# EAGLE design GSM_Relay (EAGLE 7.2.0)
COMPANY: ADAFRUIT INDUSTRIES; DRAWN: KTOWN; REV: C
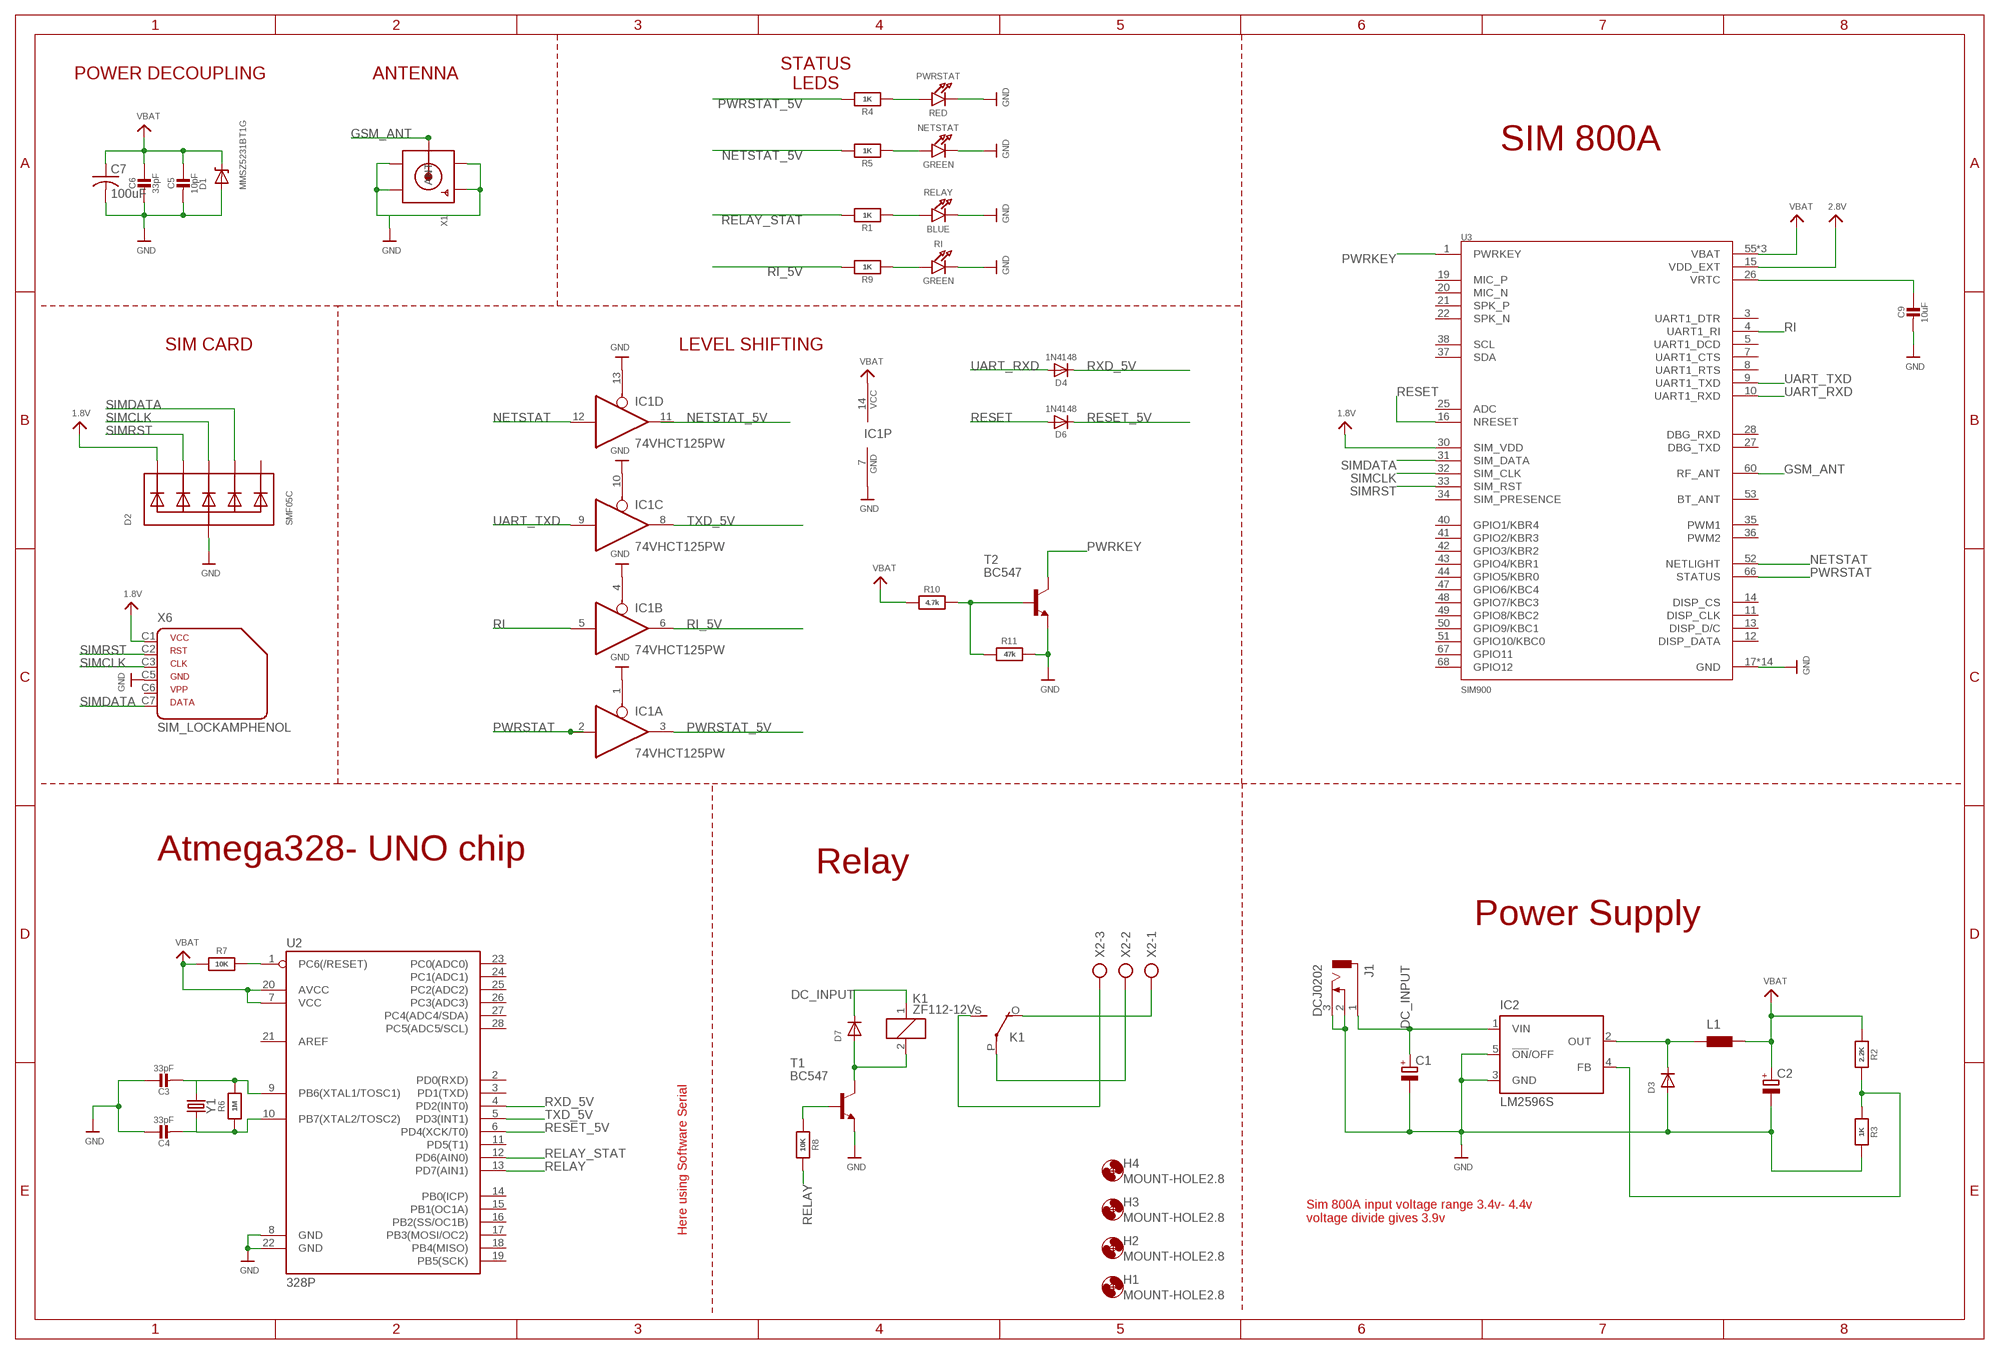
[diagram p0: schematic, sheet 1]

## Parts
C1  CPOL-EUE  [PANASONIC_E]
C2  CPOL-EUE  [PANASONIC_E]
C3  33pF  CAP_CERAMIC0805-NOOUTLINE  [0805-NO]
C4  33pF  CAP_CERAMIC0805-NOOUTLINE  [0805-NO]
C5  10pF  CAP_CERAMIC0805-NOOUTLINE  [0805-NO]
C6  33pF  CAP_CERAMIC0805-NOOUTLINE  [0805-NO]
C7  100uF  C-USC1210  [C1210]
C9  10uF  CAP_CERAMIC0805-NOOUTLINE  [0805-NO]
D1  MMSZ5231BT1G  DIODE-ZENERSOD123  [SOD-123]
D2  SMF05C  TVSARRAY_5LANE  [SOT363]
D3  DIODESMA  [SMADIODE]
D4  1N4148  DIODESOD-323  [SOD-323]
D6  1N4148  DIODESOD-323  [SOD-323]
D7  DIODESMA  [SMADIODE]
H1  MOUNT-HOLE2.8  [2,8]
H2  MOUNT-HOLE2.8  [2,8]
H3  MOUNT-HOLE2.8  [2,8]
H4  MOUNT-HOLE2.8  [2,8]
IC1  74VHCT125PW  74ABT125PW  [TSSOP14]
IC2  LM2596S  [TO263-5]
J1  DCJ0202  [DCJ0202]
K1  ZF112-12V  ZF112  [ZF112]
L1  PIS4720  [PIS4720]
NETSTAT  GREEN  LED0805_NOOUTLINE  [CHIPLED_0805_NOOUTLINE]
PWRSTAT  RED  LED0805_NOOUTLINE  [CHIPLED_0805_NOOUTLINE]
R1  1K  RESISTOR0805_NOOUTLINE  [0805-NO]
R2  2.2K  RESISTOR0805_NOOUTLINE  [0805-NO]
R3  1K  RESISTOR0805_NOOUTLINE  [0805-NO]
R4  1K  RESISTOR0805_NOOUTLINE  [0805-NO]
R5  1K  RESISTOR0805_NOOUTLINE  [0805-NO]
R6  1M  RESISTOR0805_NOOUTLINE  [0805-NO]
R7  10K  RESISTOR0805_NOOUTLINE  [0805-NO]
R8  10K  RESISTOR0805_NOOUTLINE  [0805-NO]
R9  1K  RESISTOR0805_NOOUTLINE  [0805-NO]
R10  4.7k  RESISTOR0805_NOOUTLINE  [0805-NO]
R11  47k  RESISTOR0805_NOOUTLINE  [0805-NO]
RELAY  BLUE  LED0805_NOOUTLINE  [CHIPLED_0805_NOOUTLINE]
RI  GREEN  LED0805_NOOUTLINE  [CHIPLED_0805_NOOUTLINE]
T1  BC547  2N2222  [TO92-EBC-OVAL]
T2  BC547  2N2222  [TO92-EBC-OVAL]
U2  328P  ATMEGA328P_PDIP  [DIP28]
U3  SIM900  [QFN100P2400X2400X300-68N]
X1  SMACONNECTOR  [SMA90_DIP]
X2  AK300/3  [AK300/3]
X6  SIM_LOCKAMPHENOL  [C707_10M006_512_2]
Y1  CRYSTALPTH-HC49UV  [HC49U]

## Nets
1.8V: D2.1(C1) U3.30(SIM_VDD) X6.C1
2.8V: U3.15(VDD_EXT)
DC_INPUT: C1.+ D7.C IC2.1(VIN) J1.1 K1.1
FEEDBACK: IC2.4(FB) R2.2 R3.1
GND: C1.- C2.- C3.1 C4.1 C5.2 C6.2 C7.2 C9.2 D1.A D2.2(A) D3.A IC1.1(A:OE) IC1.4(B:OE) IC1.7(P:GND) IC1.10(C:OE) IC1.13(D:OE) IC2.3(GND) IC2.5(!ON!/OFF) J1.2 J1.3 NETSTAT.C PWRSTAT.C R3.2 R11.2 RELAY.C RI.C T1.E T2.E U2.8(GND) U2.22(GND) U3.17(GND) U3.18(GND) U3.29(GND) U3.39(GND) U3.45(GND) U3.46(GND) U3.54(GND) U3.58(GND) U3.59(GND) U3.61(GND) U3.62(GND) U3.63(GND) U3.64(GND) U3.65(GND) X1.GND1 X1.GND2 X1.GND3 X1.GND4 X6.C5
GSM_ANT: U3.60(RF_ANT) X1.ANTENNA(ANT)
N$1: R1.1 RELAY.A
N$2: D7.A K1.2 T1.C
N$3: R8.1 T1.B
N$4: PWRSTAT.A R4.1
N$5: D3.C IC2.2(OUT) L1.P$1
N$6: C3.2 R6.2 U2.9(PB6(XTAL1/TOSC1)) Y1.1
N$7: C4.2 R6.1 U2.10(PB7(XTAL2/TOSC2)) Y1.2
N$8: R9.1 RI.A
N$9: NETSTAT.A R5.1
N$10: K1.O(2:O) X2.1
N$11: K1.P(2:P) X2.2
N$12: R7.2 U2.1(PC6(/RESET))
N$13: R10.2 R11.1 T2.B
N$14: K1.S(2:S) X2.3
NETSTAT: IC1.12(D:I) U3.52(NETLIGHT)
NETSTAT_5V: IC1.11(D:O) R5.2
PWRKEY: T2.C U3.1(PWRKEY)
PWRSTAT: IC1.2(A:I) U3.66(STATUS)
PWRSTAT_5V: IC1.3(A:O) R4.2
RELAY: R8.2 U2.13(PD7(AIN1))
RELAY_STAT: R1.2 U2.12(PD6(AIN0))
RESET: D6.A U3.16(NRESET)
RESET_5V: D6.C U2.6(PD4(XCK/T0))
RI: IC1.5(B:I) U3.4(UART1_RI)
RI_5V: IC1.6(B:O) R9.2
RXD_5V: D4.C U2.4(PD2(INT0))
SIMCLK: D2.4(C3) U3.32(SIM_CLK) X6.C3
SIMDATA: D2.5(C4) U3.31(SIM_DATA) X6.C7
SIMRST: D2.3(C2) U3.33(SIM_RST) X6.C2
TXD_5V: IC1.8(C:O) U2.5(PD3(INT1))
UART_RXD: D4.A U3.10(UART1_RXD)
UART_TXD: IC1.9(C:I) U3.9(UART1_TXD)
VBAT: C2.+ C5.1 C6.1 C7.1 D1.C IC1.14(P:VCC) L1.P$2 R2.1 R7.1 R10.1 U2.7(VCC) U2.20(AVCC) U3.55(VBAT) U3.56(VBAT) U3.57(VBAT)
VRTC: C9.1 U3.26(VRTC)
Unconnected: D2.6(C5) U2.2(PD0(RXD)) U2.3(PD1(TXD)) U2.11(PD5(T1)) U2.14(PB0(ICP)) U2.15(PB1(OC1A)) U2.16(PB2(SS/OC1B)) U2.17(PB3(MOSI/OC2)) U2.18(PB4(MISO)) U2.19(PB5(SCK)) U2.21(AREF) U2.23(PC0(ADC0)) U2.24(PC1(ADC1)) U2.25(PC2(ADC2)) U2.26(PC3(ADC3)) U2.27(PC4(ADC4/SDA)) U2.28(PC5(ADC5/SCL)) U3.3(UART1_DTR) U3.5(UART1_DCD) U3.7(UART1_CTS) U3.8(UART1_RTS) U3.11(DISP_CLK) U3.12(DISP_DATA) U3.13(DISP_D/C) U3.14(DISP_CS) U3.19(MIC_P) U3.20(MIC_N) U3.21(SPK_P) U3.22(SPK_N) U3.25(ADC) U3.27(DBG_TXD) U3.28(DBG_RXD) U3.34(SIM_PRESENCE) U3.35(PWM1) U3.36(PWM2) U3.37(SDA) U3.38(SCL) U3.40(GPIO1/KBR4) U3.41(GPIO2/KBR3) U3.42(GPIO3/KBR2) U3.43(GPIO4/KBR1) U3.44(GPIO5/KBR0) U3.47(GPIO6/KBC4) U3.48(GPIO7/KBC3) U3.49(GPIO8/KBC2) U3.50(GPIO9/KBC1) U3.51(GPIO10/KBC0) U3.53(BT_ANT) U3.67(GPIO11) U3.68(GPIO12) X6.C6

## Notes on the sheet
- POWER DECOUPLING | ANTENNA
- STATUS
  LEDS
- SIM 800A
- SIM CARD | LEVEL SHIFTING
- Atmega328- UNO chip
- Relay
- Power Supply
- Sim 800A input voltage range 3.4v- 4.4v
  voltage divide gives 3.9v
- Here using Software Serial

## Library data of the parts
C1 C2 = rcl:CPOL-EU: POLARIZED CAPACITOR, European symbol
C3-C6 C9 = microbuilder:CAP_CERAMIC: Ceramic Capacitors For new designs, use the packages preceded by an '_' character since they are more reliable: The following footprints should be used on most boards: _0402 - Standard footprint for regular board layouts _0603 - Standard footprint for regular board layouts _0805 - Standard footprint for regular board layouts _1206 - Standard footprint for regular board layouts For extremely tight-pitch boards where space is at a premium, the following 'micro-pitch' footprints can be used (smaller pads, no silkscreen outline, etc.): _0402MP - Micro-pitch footprint for very dense/compact boards _0603MP - Micro-pitch footprint for very dense/compact boards _0805MP - Micro-pitch footprint for very dense/compact boards _1206MP - Micro-pitch footprint for very dense/compact boards
C7 = rcl:C-US: CAPACITOR, American symbol
D1 = microbuilder:DIODE-ZENER: Zener Diode SMA: 30V 1W Zener Diode, 1.2Vf - Digikey: SMAZ30-FDICT-ND
D2 = microbuilder:TVSARRAY_5LANE: Voltage Transient Suppressor Array SOT363 SMF05C - 100W 5V: Digikey - SMF05CT1GOSCT-ND
D3 D7 = adafruit:DIODE: Diode
D4 D6 = microbuilder:DIODE: Diode
H1-H4 = holes:MOUNT-HOLE: MOUNTING HOLE with drill center marker
IC1 = 74xx-us:74*125: Quad bus BUFFER, 3-state
IC2 = national-semiconductor:LM2596: SIMPLE SWITCHER® Power Converter 150 kHz 3A Step-Down Voltage Regulator Source: http://www.national.com/ds/LM/LM2596.pdf; MF: NATIONAL SEMICONDUCTOR; MPN: LM2596S-ADJ/NOPB; OC_FARNELL: 9494367; OC_NEWARK: 41K3842
J1 = con-jack:DCJ0202: DC POWER JACK Source: DCJ0202.pdf; OC_FARNELL: unknown; OC_NEWARK: unknown
K1 = relay:ZF112: RELAY 1 x switch; OC_FARNELL: unknown; OC_NEWARK: unknown
L1 = inductor-fastron:PIS4720: Fastron SMD Power Inductors Source: http://www.fastrongroup.com/series/52/findProducts
NETSTAT PWRSTAT RELAY RI = microbuilder:LED: LED 0603 - 0603 Surface Mount Package 2mA: Green LED - Low Power (3.9mcd, 2ma, 1.7Vf) - Digikey: 475-2709-2-ND Orange LED - Low Power (9.8mcd, 2ma, 1.8Vf) - Digikey: 475-1194-2-ND Red LED - Low Power (5mcd, 2ma, 1.8Vf) - Digikey: 475-1195-2-ND Yellow LED - Low Power (7mcd, 2ma, 1.8Vf) - Digikey: 475-1196-2-ND 5mA: Blue LED - Low Power (17mcd, 5ma, 2.9Vf) - Digikey: LNJ937W8CRACT-ND 0805 - 0805 Surface Mount Package 2mA: Red LED (8.8mcd, 2mA, 1.8Vf, Clear) - Low Power [Digikey: 475-2510-1-ND] Green LED (5mcd, 2mA, 1.8Vf, Clear) - Low Power [Digikey: 475-2730-1-ND] Yellow LED (11.3mcd, 2mA, 1.8Vf, Clear) - Low Power [Digikey: 475-2555-1-ND] 20mA: Red LED (104mcd, 20mA, Diffused) - LS R976 [Digikey: 475-1278-6-ND] Red LED (12mcd, 20mA, 2.0Vf, Clear) - APT2012EC [Digikey: 754-1128-1-ND] Green LED (15mcd, 20mA, 2.2Vf, Clear) - APT2012GC [Digikey: 754-1131-1-ND] Orange LED (160mcd, 20mA, 2.1Vf, Clear) - APT2012SECK [Digikey: 754-1130-1-ND] 1206 - 1206 Surface Mount Package Green LED (26mcd, 20mA, Diffused) - LG N971 [Digikey: 475-1407-6-ND] Red LED (15mcd, 20mA, Diffused) - LH N974 [Digikey: 475-1416-6-ND] Cree - Cree High-Power Surface Mount LEDs XPEBWT-L1-0000-00D50 - White 111lm 350mA 2.9Vf 6200K 110° XTEAWT-00-0000-00000LEE3 - White 114lm 350mA 2.85Vf 5000K 115° Everlight - Everlight 45-21 Series Surface Mount LEDs 45-21/QK2C-B2832AC2CB2/2T - Warm White 2000mcd 20mA 3.25Vf 3050K 120° 45-21/LK2C-B38452C4CB2/2T - Nuetral White 2000mcd 20mA 3.25Vf 4150K 120° 45-21/LK2C-B50634C6CB2/2T - Cold White 2200mcd 20mA 3.25Vf 5650K 120° PLCC2 Reverse Mount LS T77K-J1L2-1-0-2-R18-Z - Red 11.25mcd 2mA 1.8Vf 630nm 120° LO T77K-L1M2-24-Z - Orange 19.6mcd 2mA 1.8Vf 606nm 120° LY T77K-K2M1-26-Z - Yellow 15.7mcd 2mA 1.8Vf 587nm 120°
R1-R11 = microbuilder:RESISTOR: Resistors For new designs, use the packages preceded by an '_' character since they are more reliable: The following footprints should be used on most boards: _0402 - Standard footprint for regular board layouts _0603 - Standard footprint for regular board layouts _0805 - Standard footprint for regular board layouts _1206 - Standard footprint for regular board layouts For extremely tight-pitch boards where space is at a premium, the following 'micro-pitch' footprints can be used (smaller pads, no silkscreen outline, etc.): _0402MP - Micro-pitch footprint for very dense/compact boards _0603MP - Micro-pitch footprint for very dense/compact boards _0805MP - Micro-pitch footprint for very dense/compact boards _1206MP - Micro-pitch footprint for very dense/compact boards
T1 T2 = adafruit:2N2222: NPN TRANSISTOR Big oval pads
U2 = SparkFun-IC-Microcontroller:ATMEGA328P_PDIP: Atmel 328P Through hole ATMEGA328P uC used in the Arduino 32kb flash, 1k EEPROM, 2k SRAM Datasheet <http://www.sparkfun.com/datasheets/Components/SMD/ATMega328.pdf> SparkFun Products Storefront component: AVR 28 Pin 20MHz 32K 6A/D - ATMega328P <https://www.sparkfun.com/products/9061> (COM-09061) SparkFun Simon Says - Through-Hole Soldering Kit <https://www.sparkfun.com/products/10547> (KIT-10547) SparkFun Learn to Solder - Simon Says <https://www.sparkfun.com/products/13708> (KIT-13708) SparkFun BigTime Watch Kit <https://www.sparkfun.com/products/11734> (KIT-11734) SparkFun ClockIt <https://www.sparkfun.com/products/10930> (KIT-10930) SparkFun Serial Enabled LCD Kit <https://www.sparkfun.com/products/10097> (LCD-10097) SparkFun Simon Tilts - Through Hole Soldering Kit <https://www.sparkfun.com/products/12634> (KIT-12634) SparkFun Frequency Counter Kit <https://www.sparkfun.com/products/10140> (KIT-10140) FabFM Radio Kit <https://www.sparkfun.com/products/11043> (KIT-11043) SparkFun Binary Blaster Kit <https://www.sparkfun.com/products/12037> (KIT-12037) SparkFun Metro-Gnome <https://www.sparkfun.com/products/9236> (KIT-09236) ATmega328 with Arduino Optiboot (Uno) <https://www.sparkfun.com/products/10524> (DEV-10524); PROD_ID: IC-09136
U3 = SIM900:SIM900: GSM / GPRS Module http://simcom.ee/documents/SIM900/SIM900_Hardware%20Design_V2.05.pdf; AVAILABILITY: Unavailable; DESCRIPTION: Module%3A GSM%3B CSD%2C GPRS%3B 2G%3B 1800MHz%2C 900MHz%3B 85.6kbps%3B I; MF: Simcom; MP: SIM900; PACKAGE: DIP-60 Simcom; PRICE: None
X1 = adafruit:SMACONNECTOR: SMA Connector 90° DIP SMA Connector, 50 Ohm (4UConnector: 07259)
X2 = con-ptr500:AK300/3: CONNECTOR; OC_FARNELL: unknown; OC_NEWARK: unknown
X6 = microbuilder:SIM_LOCK: C707A SIMLOCK® 2.5 mm with wide solder tails Source: Data sheet <http://www.amphenol.info/downloads/C707_10M006_512_2.pdf>; OC_FARNELL: unknown; OC_NEWARK: unknown
Y1 = SparkFun-Clocks:CRYSTAL: Crystals (Generic) These are passive quartz crystals, which can be used as a clock source for a microcontroller. Crystal's are two-terminal devices. They require external "load" capacitors to generate an oscillating signal.

## Board
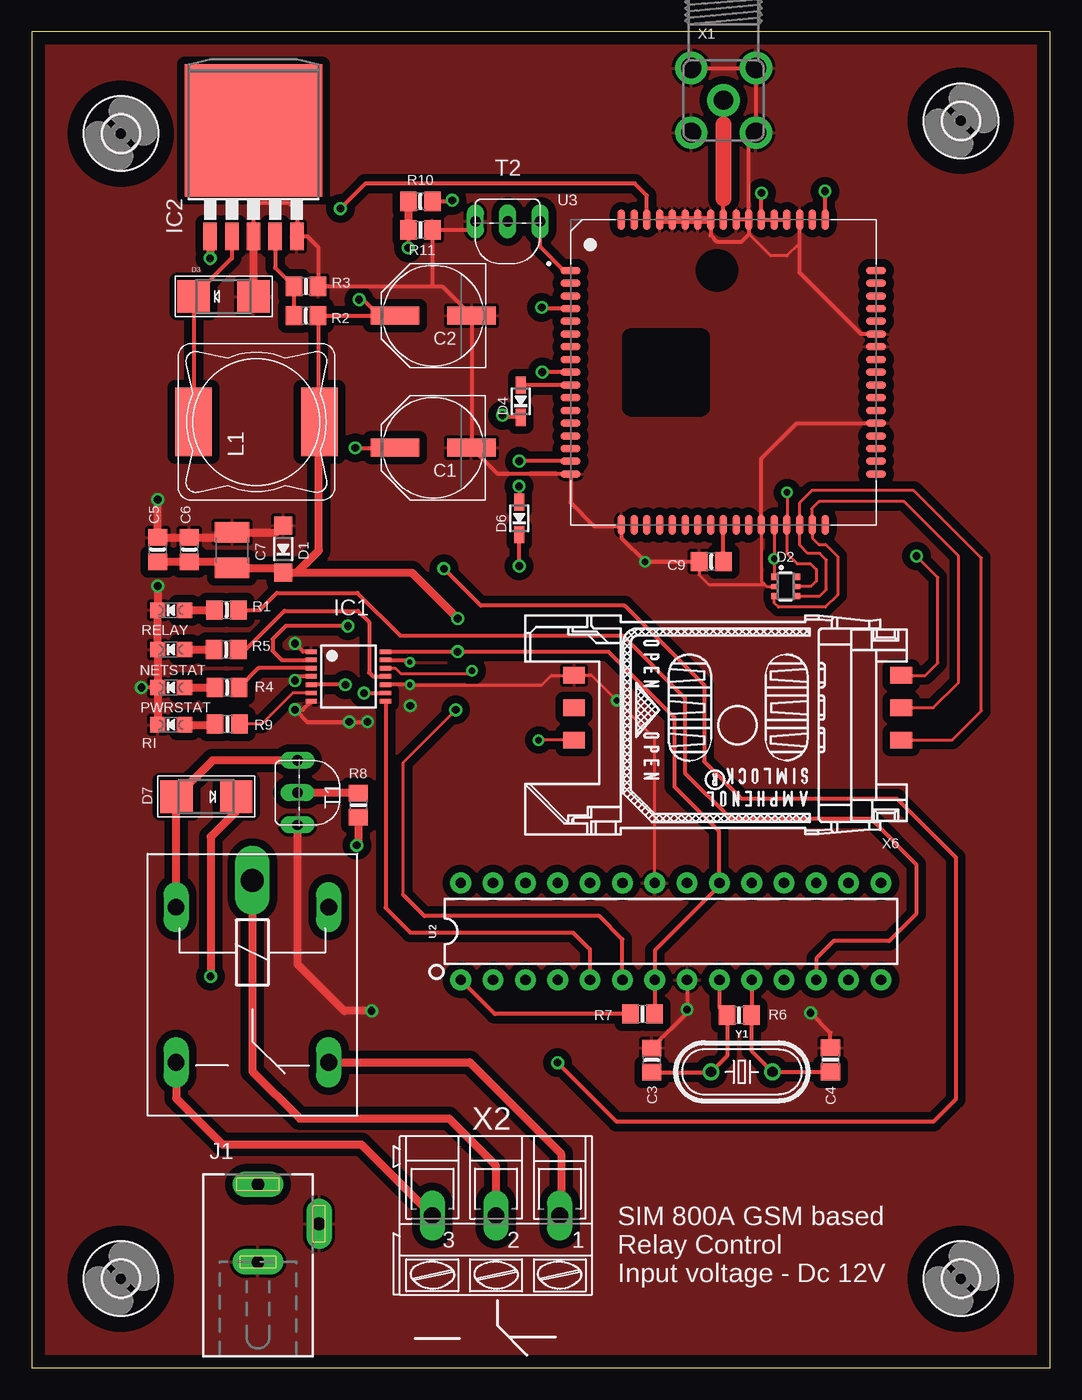
[diagram p1: board, top side]
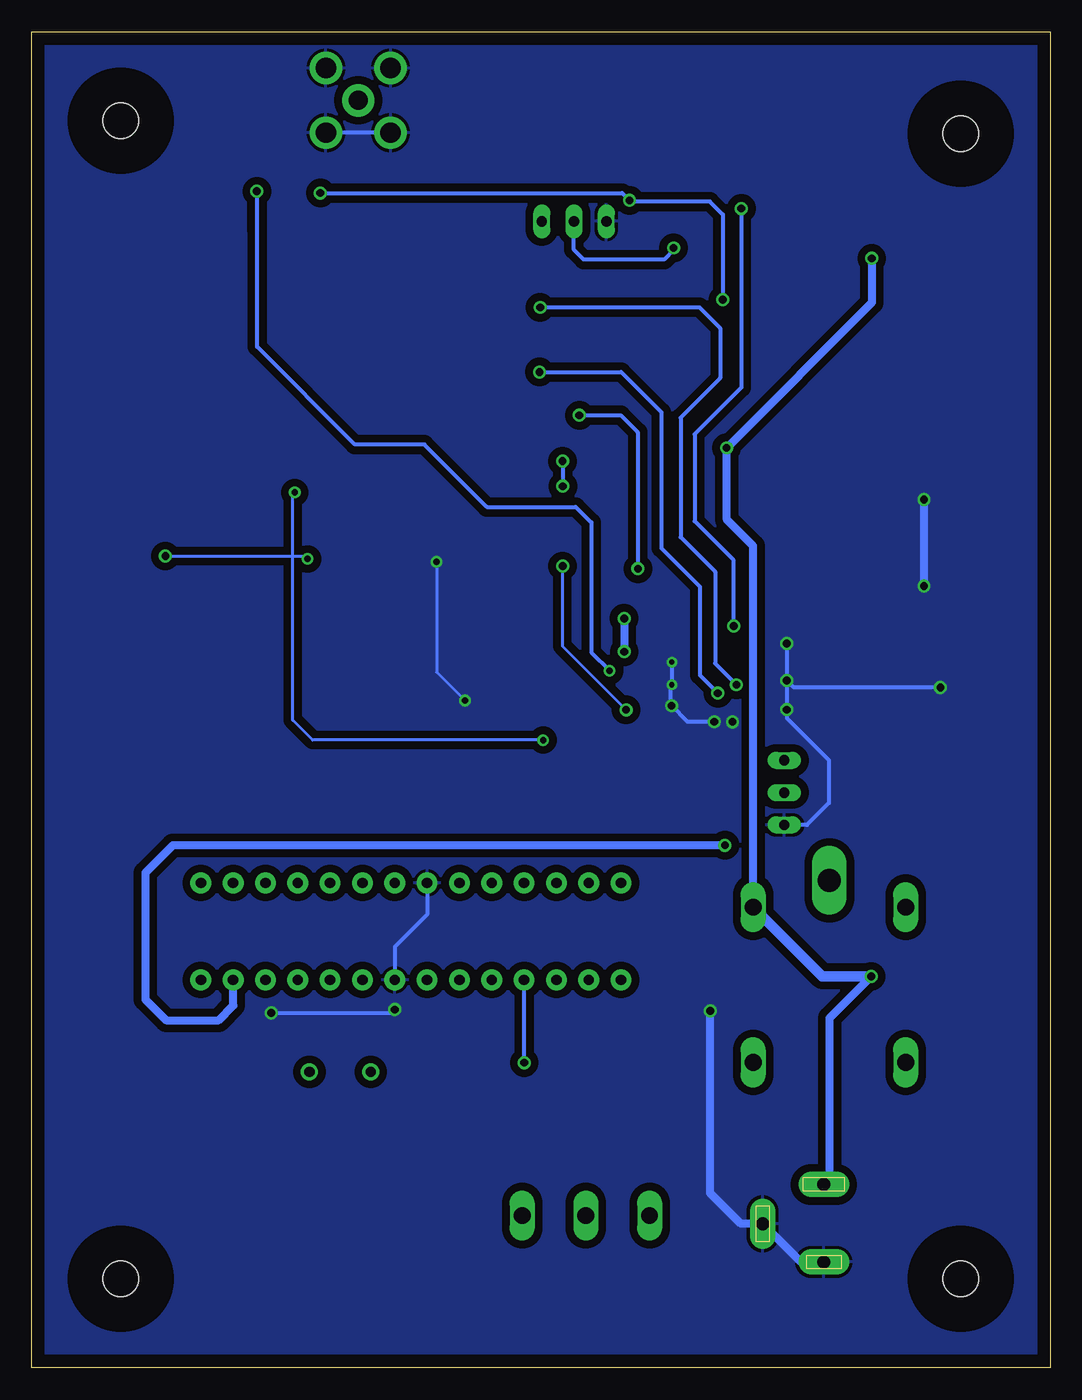
[diagram p2: board, bottom side, seen from below]

Size 80 x 105 mm. Coordinates in mm from the lower left corner, seen from the top.
Outline: 0,0 80,0 80,105 0,105 0,0
Copper layers (1*16): Top 0.035mm / dielectric 1.5mm / Bottom 0.035mm
Design rules "default": minimum track width 10mil, minimum drill 24mil, track to track 8mil, track to pad 8mil, pad to pad 8mil, via to via 8mil, smd to smd 8mil, copper to edge 40mil, drill to drill 8mil, minimum pad ring 10mil, minimum via ring 8mil, stop-mask expansion 4mil, vias tented up to drill 0mil, thermal gap 10mil

### Footprints (pad centres in the part's own frame; a part is rotated, then mirrored left to right if it is on the bottom)
PANASONIC_E = smd 3.8 x 1.4: + 3,0; - -3,0
0805-NO = smd 1.3 x 1.5: 1 -0.95,0; 2 0.95,0
C1210 = smd 1.6 x 2.7: 1 -1.4,0; 2 1.4,0
SOD-123 = smd 1.4 x 1.4: A 1.85,0; C -1.85,0
SOT363 = smd 0.5 x 0.5: 1 -0.75,-0.9; 3 0.75,-0.9; 4 0.75,0.9; 6 -0.75,0.9 | smd 0.4 x 0.5: 2 0,-0.9; 5 0,0.9
SMADIODE = smd 2.54 x 2.54: A 2.349,0; C -2.349,0
SOD-323 = smd 1.35 x 0.8: A 1.27,0; C -1.27,0
2,8 = hole 2.8: 0,0
TSSOP14 = smd 0.35 x 0.9: 1 -1.95,-2.925; 2 -1.3,-2.925; 3 -0.65,-2.925; 4 0,-2.925; 5 0.65,-2.925; 6 1.3,-2.925; 7 1.95,-2.925; 8 1.95,2.925; 9 1.3,2.925; 10 0.65,2.925; 11 0,2.925; 12 -0.65,2.925; 13 -1.3,2.925; 14 -1.95,2.925
TO263-5 = smd 1.067 x 2.159: 1 -3.404,-5.791; 2 -1.702,-5.791; 3 0,-5.791; 4 1.702,-5.791; 5 3.404,-5.791 | smd 10.8 x 10.41: GND 0,2.54
DCJ0202 = drill 1 pad 2 long: 1 0,3.1; 2 4.8,0; 3 0,-3
ZF112 = drill 1.321 long: 1 -6.096,5.994; 2 -6.096,-5.994; O 6.096,5.994; S 6.096,-5.994 | drill 1.803 long: P -8.204,0
PIS4720 = smd 5.4 x 2.9: P$1 0,4.95; P$2 0,-4.95
CHIPLED_0805_NOOUTLINE = smd 1.2 x 1.2: A 0,-1.05; C 0,1.05
TO92-EBC-OVAL = drill 0.813 long: B 0,-1.27; C 2.54,-1.27; E -2.54,-1.27
DIP28 = drill 0.813 pad 1.626: 1 -16.51,-3.81; 2 -13.97,-3.81; 3 -11.43,-3.81; 4 -8.89,-3.81; 5 -6.35,-3.81; 6 -3.81,-3.81; 7 -1.27,-3.81; 8 1.27,-3.81; 9 3.81,-3.81; 10 6.35,-3.81; 11 8.89,-3.81; 12 11.43,-3.81; 13 13.97,-3.81; 14 16.51,-3.81; 15 16.51,3.81; 16 13.97,3.81; 17 11.43,3.81; 18 8.89,3.81; 19 6.35,3.81; 20 3.81,3.81; 21 1.27,3.81; 22 -1.27,3.81; 23 -3.81,3.81; 24 -6.35,3.81; 25 -8.89,3.81; 26 -11.43,3.81; 27 -13.97,3.81; 28 -16.51,3.81
QFN100P2400X2400X300-68N = smd 1.6 x 0.6: 1 -12,8; 2 -12,7; 3 -12,6; 4 -12,5; 5 -12,4; 6 -12,3; 7 -12,2; 8 -12,1; 9 -12,0; 10 -12,-1; 11 -12,-2; 12 -12,-3; 13 -12,-4; 14 -12,-5; 15 -12,-6; 16 -12,-7; 17 -12,-8; 35 12,-8; 36 12,-7; 37 12,-6; 38 12,-5; 39 12,-4; 40 12,-3; 41 12,-2; 42 12,-1; 43 12,0; 44 12,1; 45 12,2; 46 12,3; 47 12,4; 48 12,5; 49 12,6; 50 12,7; 51 12,8 | smd 0.6 x 1.6: 18 -8,-12; 19 -7,-12; 20 -6,-12; 21 -5,-12; 22 -4,-12; 23 -3,-12; 24 -2,-12; 25 -1,-12; 26 0,-12; 27 1,-12; 28 2,-12; 29 3,-12; 30 4,-12; 31 5,-12; 32 6,-12; 33 7,-12; 34 8,-12; 52 8,12; 53 7,12; 54 6,12; 55 5,12; 56 4,12; 57 3,12; 58 2,12; 59 1,12; 60 0,12; 61 -1,12; 62 -2,12; 63 -3,12; 64 -4,12; 65 -5,12; 66 -6,12; 67 -7,12; 68 -8,12
SMA90_DIP = drill 1.5 pad 2.54: ANTENNA 0,0 | drill 1.6 pad 2.54: GND1 -2.54,2.54; GND2 2.54,2.54; GND3 -2.54,-2.54; GND4 2.54,-2.54
AK300/3 = drill 1.321 long: 1 -5.004,0; 2 0,0; 3 5.004,0
C707_10M006_512_2 = smd 1.7 x 1.3: C1 -12.85,-3.915; C2 -12.85,-1.375; C3 -12.85,1.165; C5 12.85,-3.915; C6 12.85,-1.375; C7 12.85,1.165
HC49U = drill 0.813: 1 -2.413,0; 2 2.413,0

### Placement (x,y rotation side)
C1  31.54,72.31 180 top
C2  31.55,82.69 180 top
C3  48.71,24.18 270 top
C4  62.75,24.2 270 top
C5  9.89,64.31 90 top
C6  12.37,64.31 90 top
C7  15.74,64.26 90 top
C9  53.39,63.36 180 top
D1  19.75,64.34 90 top
D2  59.23,61.4 270 top
D3  15.06,84.2 0 top
D4  38.42,75.97 90 top
D6  38.3,66.76 90 top
D7  13.71,44.89 180 top
H1  73,7 0 top
H2  73,98 0 top
H3  7,7 0 top
H4  7,97 0 top
IC1  24.88,54.33 270 top
IC2  17.42,94.72 0 top
J1  17.77,11.31 0 top
K1  17.33,30.1 270 top
L1  17.65,74.34 90 top
NETSTAT  10.94,56.45 90 top
PWRSTAT  10.95,53.46 90 top
R1  15.3,59.55 0 top
R2  21.54,82.68 180 top
R3  21.54,84.99 0 top
R4  15.34,53.46 0 top
R5  15.27,56.44 0 top
R6  55.58,27.71 180 top
R7  47.99,27.8 180 top
R8  25.66,44.21 270 top
R9  15.36,50.59 0 top
R10  30.53,91.67 180 top
R11  30.53,89.43 0 top
RELAY  10.94,59.54 90 top
RI  10.94,50.53 90 top
T1  19.61,45.2 90 top
T2  37.39,91.37 0 top
U2  50.21,34.29 0 top
U3  54.33,78.24 0 top
X1  54.35,99.61 0 top
X2  36.47,11.96 180 top
X6  55.46,50.5 180 top
Y1  55.78,23.25 0 top

### Tracks (layer width: path | path; a pad name or v marks a point on that pad's centre or on a via)
1.8V  (via drill 0.5, 0.6)
  Top 0.254: U3.30 58.33,63.8 v58.33,63.57 D2.1 | X6.C1 70.21,54.41 71.19,55.4 71.19,62.12 v69.51,63.8
  Bottom 0.254: v69.51,63.8 58.56,63.8 v58.33,63.57
DC_INPUT  (via drill 0.6)
  Top 0.305: 14.02,86.97 v14.01,87.2 | v25.41,72.3 C1.+
  Top 0.61: IC2.1 14.02,86.97 | D7.C 16.06,43.73 14.05,41.72 v14.05,30.76
  Bottom 0.305: 25.39,72.28 v25.41,72.3
  Bottom 0.61: v14.01,87.2 13.99,83.72 v25.41,72.3 | K1.1 23.32,64.58 25.39,66.65 25.39,72.28 | v14.05,30.76 17.32,27.49 17.32,14.86 J1.1
  Bottom 0.813: v14.05,30.76 17.89,30.76 K1.1
FEEDBACK
  Top 0.305: IC2.4 19.12,86.46 R3.1 R2.2
GND  (via drill 0.4, 0.5, 0.6, 0.61)
  Top 0.254: U3.29 57.33,61.81 57.53,61.61 | 57.53,61.61 57.74,61.4 D2.2 | C9.2 52.44,62.31 53.2,61.55 57.47,61.55 57.53,61.61 | v29.71,53.68 v29.72,53.67 40.07,53.67 40.82,54.42 X6.C5 43.98,54.42 v45.96,52.44 48.94,49.46 U2.22 | U3.54 60.33,88.4 59.33,87.39 58.06,87.39 56.37,89.08
  Top 0.305: R3.2 22.5,88.08 21.65,88.93 IC2.5 20.84,88.94 20.84,90.92 20.2,91.56 17.94,91.56 17.42,91.04 IC2.3 | R3.2 | R3.2 31.49,85 | 31.49,85 32.24,85 C2.- C1.- 36.61,70.24 U3.17 42.33,68.01 44.17,66.17 46.26,66.17 U3.18 46.33,65.21 v48.19,63.35 C9.2 | U3.29 57.33,71.47 60.1,74.24 U3.39 | U3.46 65.16,81.24 60.32,86.08 U3.54 | IC1.4 20.99,54.33 v20.68,54.02 | IC1.1 21.32,56.28 v20.68,56.92 | IC1.7 21.3,51.72 v20.68,51.72 v20.69,51.72 21.64,50.77 24.97,50.77 | PWRSTAT.C v8.61,53.47 8.54,53.46 | v29.71,53.68 IC1.10 | U2.8 v51.48,28.15 51.48,27.9 C3.1 | C4.1 62.75,26.32 v61.19,27.88 | IC1.13 29.53,55.63 v29.71,55.45 | U3.58 U3.59 | U3.61 53.33,89.01 53.83,88.51 55.8,88.51 56.37,89.08 56.37,90.2 U3.58 | X1.GND1 X1.GND2 X1.GND4 56.33,96.51 U3.58 | 24.97,50.77 v26.38,50.77 | v24.94,50.76 24.96,50.76 24.97,50.77 | 31.49,85 31.48,85.01 R11.2 34.18,89.43 T2.E
  Top 0.61: IC2.3 D3.A | PWRSTAT.C NETSTAT.C RELAY.C v9.9,61.43 | PWRSTAT.C | PWRSTAT.C RI.C | D1.A 19.22,65.66 C7.2 15.34,65.26 C6.2 C5.2 v9.89,68.23 v9.9,68.24 | U3.65 U3.64 U3.63 U3.62 U3.61 | v26.7,28.04 24.56,28.04 20.89,31.71 T1.E
  Bottom 0.254: v48.19,63.35 48.19,54.67 v45.96,52.44
  Bottom 0.305: v20.68,56.92 v20.68,54.02 | v20.68,54.02 v20.68,51.72 20.68,51.05 17.38,47.75 17.38,44.38 19.11,42.65 T1.E | v8.61,53.47 20.13,53.47 v20.68,54.02 | v29.71,55.45 v29.71,53.68 29.79,53.6 29.79,52.09 v29.73,52.03 28.47,50.77 v26.38,50.77 | U2.22 48.94,35.61 51.47,33.08 U2.8 | v61.19,27.88 51.75,27.88 v51.48,28.15 | X1.GND3 X1.GND4
  Bottom 0.61: v9.9,68.24 v9.9,61.43 | 26.65,27.99 v26.7,28.04 26.7,13.71 24.3,11.31 J1.2 19.57,8.31 J1.3
  pour Top (isolate 0.61): 0,105 80,105 80,0 0,0
  pour Bottom (isolate 0.61): 0,105 80,105 80,0 0,0
GSM_ANT
  Top 0.305: U3.60 54.33,91.88 54.36,91.91 | 54.36,97.71 X1.ANTENNA
  Top 1.27: 54.36,91.91 54.36,97.71
N$1
  Top 0.61: RELAY.A R1.1
N$2
  Top 0.61: K1.2 11.34,44.87 D7.A 14.21,47.74 T1.C
N$3
  Top 0.61: T1.B 25.62,45.2 R8.1
N$4
  Top 0.61: PWRSTAT.A R4.1
N$5
  Top 0.305: IC2.2 15.72,87.21 D3.C L1.P$1
N$6
  Top 0.305: U2.9 54.02,28.32 R6.2 54.63,24.51 Y1.1 53.35,23.23 C3.2
N$7
  Top 0.305: U2.10 56.56,27.74 R6.1 56.53,24.91 Y1.2 C4.2
N$8
  Top 0.61: RI.A 14.35,50.53 R9.1
N$9
  Top 0.61: NETSTAT.A R5.1
N$10
  Top 0.61: K1.O 34.41,24 41.59,16.82 41.59,12.08 X2.1
N$11
  Top 0.61: K1.P 17.33,23.29 21.04,19.58 32.77,19.58 36.44,15.91 36.44,11.99 X2.2
N$12
  Top 0.305: R7.2 36.38,27.8 U2.1
N$13  (via drill 0.6)
  Top 0.305: R11.1 v29.58,88.03 v29.57,88.02
  Top 0.61: R10.2 R11.1
  Bottom 0.305: v29.57,88.02 29.57,87.86 30.32,87.11 36.65,87.11 37.4,87.86 T2.B
N$14
  Top 0.61: K1.S 11.34,21.18 14.98,17.54 25.89,17.54 X2.3
NETSTAT  (via drill 0.5, 0.61)
  Top 0.254: IC1.12 28.57,54.98 28.99,54.56 34.38,54.56 v34.6,54.78
  Top 0.305: U3.52 v62.33,92.46 v62.32,92.47
  Bottom 0.305: 62.32,89.42 v62.32,92.47 62.3,92.45 62.3,80.25 54.62,72.57 49.15,72.57 44.24,67.66 37.27,67.66 36.04,66.43 36.04,56.22 v34.6,54.78
NETSTAT_5V
  Top 0.305: R5.2 16.79,56.44 19.84,59.49 25.61,59.49 26.5,58.6 26.5,54.64 26.81,54.33 IC1.11
PWRKEY
  Top 0.305: U3.1 41.79,86.24 39.93,88.1 T2.C
PWRSTAT  (via drill 0.61)
  Top 0.305: U3.66 48.33,92.12 47.38,93.07 26.21,93.07 v24.25,91.11 | v24.84,58.3 19.96,58.3 18.93,57.27 18.93,56.34 19.63,55.64 IC1.2
  Bottom 0.305: v24.25,91.11 24.25,77.04 27.92,73.37 27.92,66.54 24.9,63.52 24.9,58.36 v24.84,58.3
PWRSTAT_5V
  Top 0.305: IC1.3 17.81,54.98 R4.2
RELAY  (via drill 0.61)
  Top 0.61: R8.2 25.66,41.18 v25.54,41.06
  Bottom 0.61: v25.54,41.06 68.91,41.06 71.08,38.89 71.08,28.94 69.45,27.31 65.33,27.31 64.17,28.47 U2.13
RELAY_STAT
  Top 0.305: R1.2 17.9,59.55 19.25,60.9 25.58,60.9 28.95,57.53 46.43,57.53 51.32,52.64 51.32,46.75 54.91,43.16 65.9,43.16 69.49,39.57 69.49,35.66 67.36,33.53 63.02,33.53 61.65,32.16 U2.12
RESET  (via drill 0.61)
  Top 0.305: U3.16 v38.31,71.24 v38.3,71.25 | v38.28,69.28 38.28,68.05 D6.A
  Bottom 0.305: v38.3,71.25 38.3,69.3 v38.28,69.28
RESET_5V  (via drill 0.61)
  Top 0.254: 29.17,37.17 29.17,47.56 v33.31,51.71
  Top 0.305: U2.6 46.4,33.68 44.59,35.49 30.85,35.49 29.17,37.17 | v38.29,63.01 D6.C
  Bottom 0.254: 38.32,62.98 38.32,56.71 v33.31,51.71
  Bottom 0.305: 38.32,62.98 v38.29,63.01
RI  (via drill 0.61)
  Top 0.305: U3.4 40.16,83.24 v40.06,83.34 | v24.64,53.68 IC1.5
  Bottom 0.305: v40.06,83.34 27.55,83.34 25.91,81.7 25.91,77.79 29.03,74.67 29.03,65.28 26.32,62.57 26.32,55.36 v24.64,53.68
RI_5V
  Top 0.254: IC1.6 20.49,53.03 18.05,50.59 R9.2
RXD_5V  (via drill 0.61)
  Top 0.305: D4.C 37.14,74.7 v36.98,74.86 | v41.31,23.97 45.95,19.33 70.83,19.33 72.61,21.11 72.61,40.09 67.97,44.73 55.75,44.73 52.82,47.66 52.82,53.65 46.58,59.89 35.29,59.89 v32.38,62.8
  Bottom 0.305: v36.98,74.86 33.74,74.86 32.4,73.52 32.4,62.82 v32.38,62.8 | v41.31,23.97 U2.4
SIMCLK
  Top 0.254: D2.4 61.89,60.65 62.42,61.18 62.42,63.5 61.91,64.01 60.97,64.01 60.34,64.64 U3.32 60.31,66.26 60.31,67.97 61.3,68.96 69.28,68.96 74.6,63.64 74.6,51.62 72.31,49.34 X6.C3
SIMDATA  (via drill 0.5)
  Top 0.254: D2.5 61.21,61.4 61.64,61.83 61.64,62.74 61.18,63.2 60.14,63.2 59.33,64.01 U3.31 v59.34,68.8 | X6.C7 v39.83,49.34 v39.82,49.33
  Bottom 0.254: v39.82,49.33 57.94,49.33 59.51,50.9 59.51,68.63 v59.34,68.8
SIMRST
  Top 0.254: D2.3 58.33,60.11 58.67,59.77 62.36,59.77 63.34,60.75 63.34,63.74 62.38,64.7 61.85,64.7 61.33,65.22 U3.33 61.28,66.29 61.28,67.51 61.84,68.07 68.54,68.07 72.82,63.79 72.82,53.86 70.84,51.88 X6.C2
TXD_5V
  Top 0.305: IC1.8 27.81,36.15 29.75,34.2 42.52,34.2 43.84,32.88 43.84,30.5 U2.5
UART_RXD
  Top 0.305: U3.10 D4.A
UART_TXD  (via drill 0.61)
  Top 0.305: U3.9 40.13,78.24 v40.11,78.26 | v26.1,53.02 IC1.9
  Bottom 0.305: v40.11,78.26 33.7,78.26 30.54,75.1 30.54,64.41 27.51,61.38 27.51,54.43 v26.1,53.02
VBAT  (via drill 0.6, 0.61)
  Top 0.305: 27.3,82.68 R2.1 22.49,74.45 L1.P$2 | 27.3,82.68 27.71,82.68 | 27.71,82.68 C2.+ | 27.72,56.28 IC1.14 33.21,56.28 | R7.1 U2.7 48.95,32.78 54.02,37.85 U2.20 53.99,38.13 53.99,42.17 50.48,45.68 50.48,51.11 45.31,56.28 v33.45,56.28 | U3.55 U3.56 U3.57 v57.33,92.33 | 27.8,82.59 27.71,82.68 | R10.1 32.95,91.67 v33.03,91.75 | v25.71,83.94 26.04,83.94 27.3,82.68
  Top 0.61: C5.1 C6.1 15.24,63.36 C7.1 19.38,62.86 D1.C 20.81,62.49 | 20.81,62.49 22.56,64.24 22.56,74.3 L1.P$2 | 20.81,62.49 29.86,62.49 v33.46,58.89 | v33.45,56.28 33.21,56.28
  Bottom 0.305: v57.33,92.33 33.61,92.33 v33.03,91.75 | v33.03,91.75 33,91.72 | v33.03,91.75 32.94,91.66 26.73,91.66 25.71,90.64 v25.71,83.94
  Bottom 0.61: v33.46,58.89 33.46,56.43 v33.45,56.28
VRTC
  Top 0.305: C9.1 U3.26

### Text on the board
tNames: SIM 800A GSM based / Relay Control / Input voltage - Dc 12V